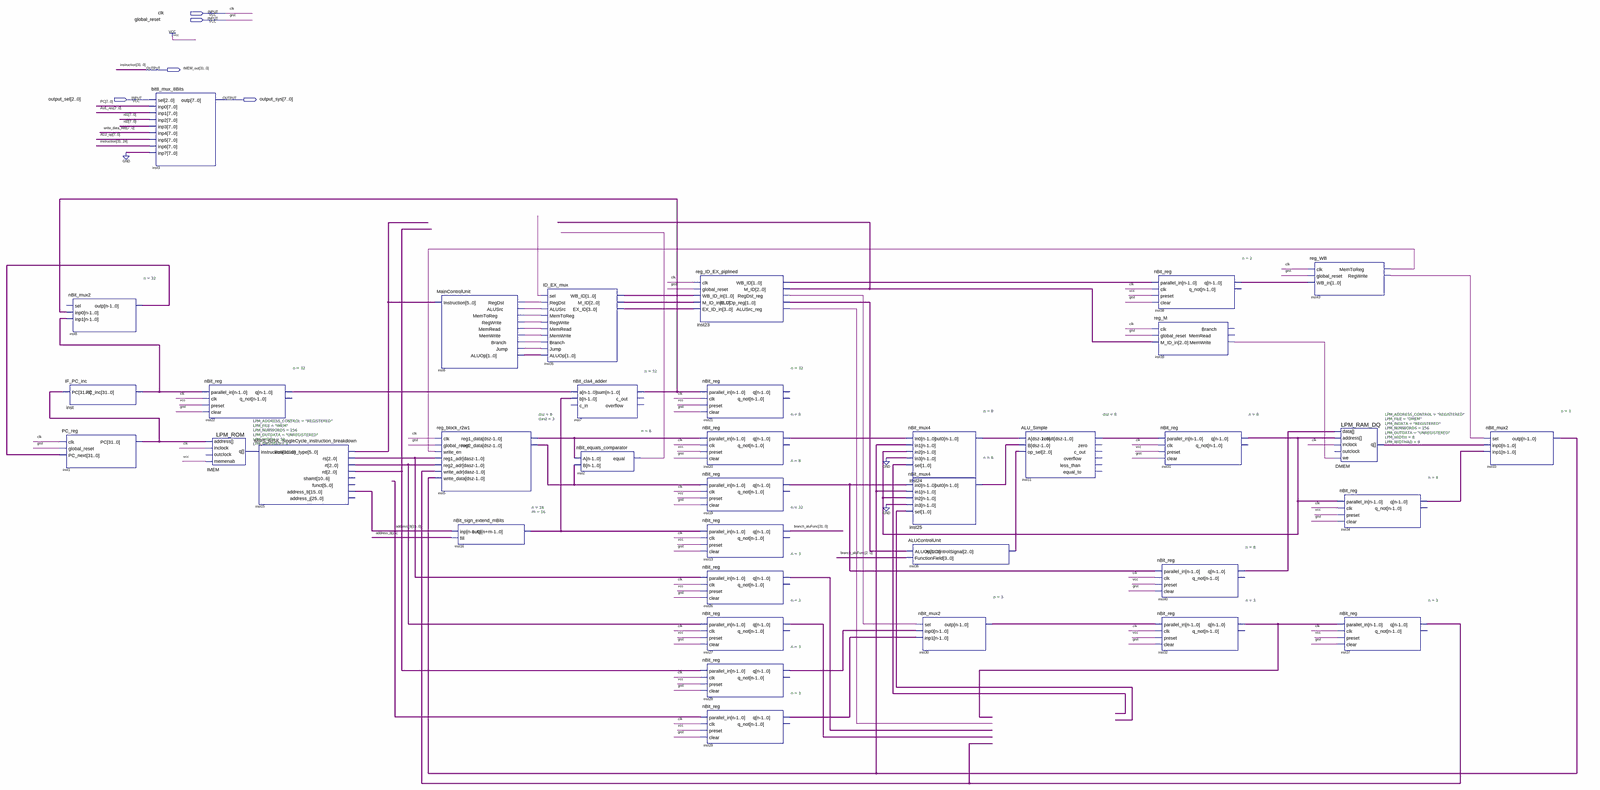
[diagram p0: schematic sheet, whole]
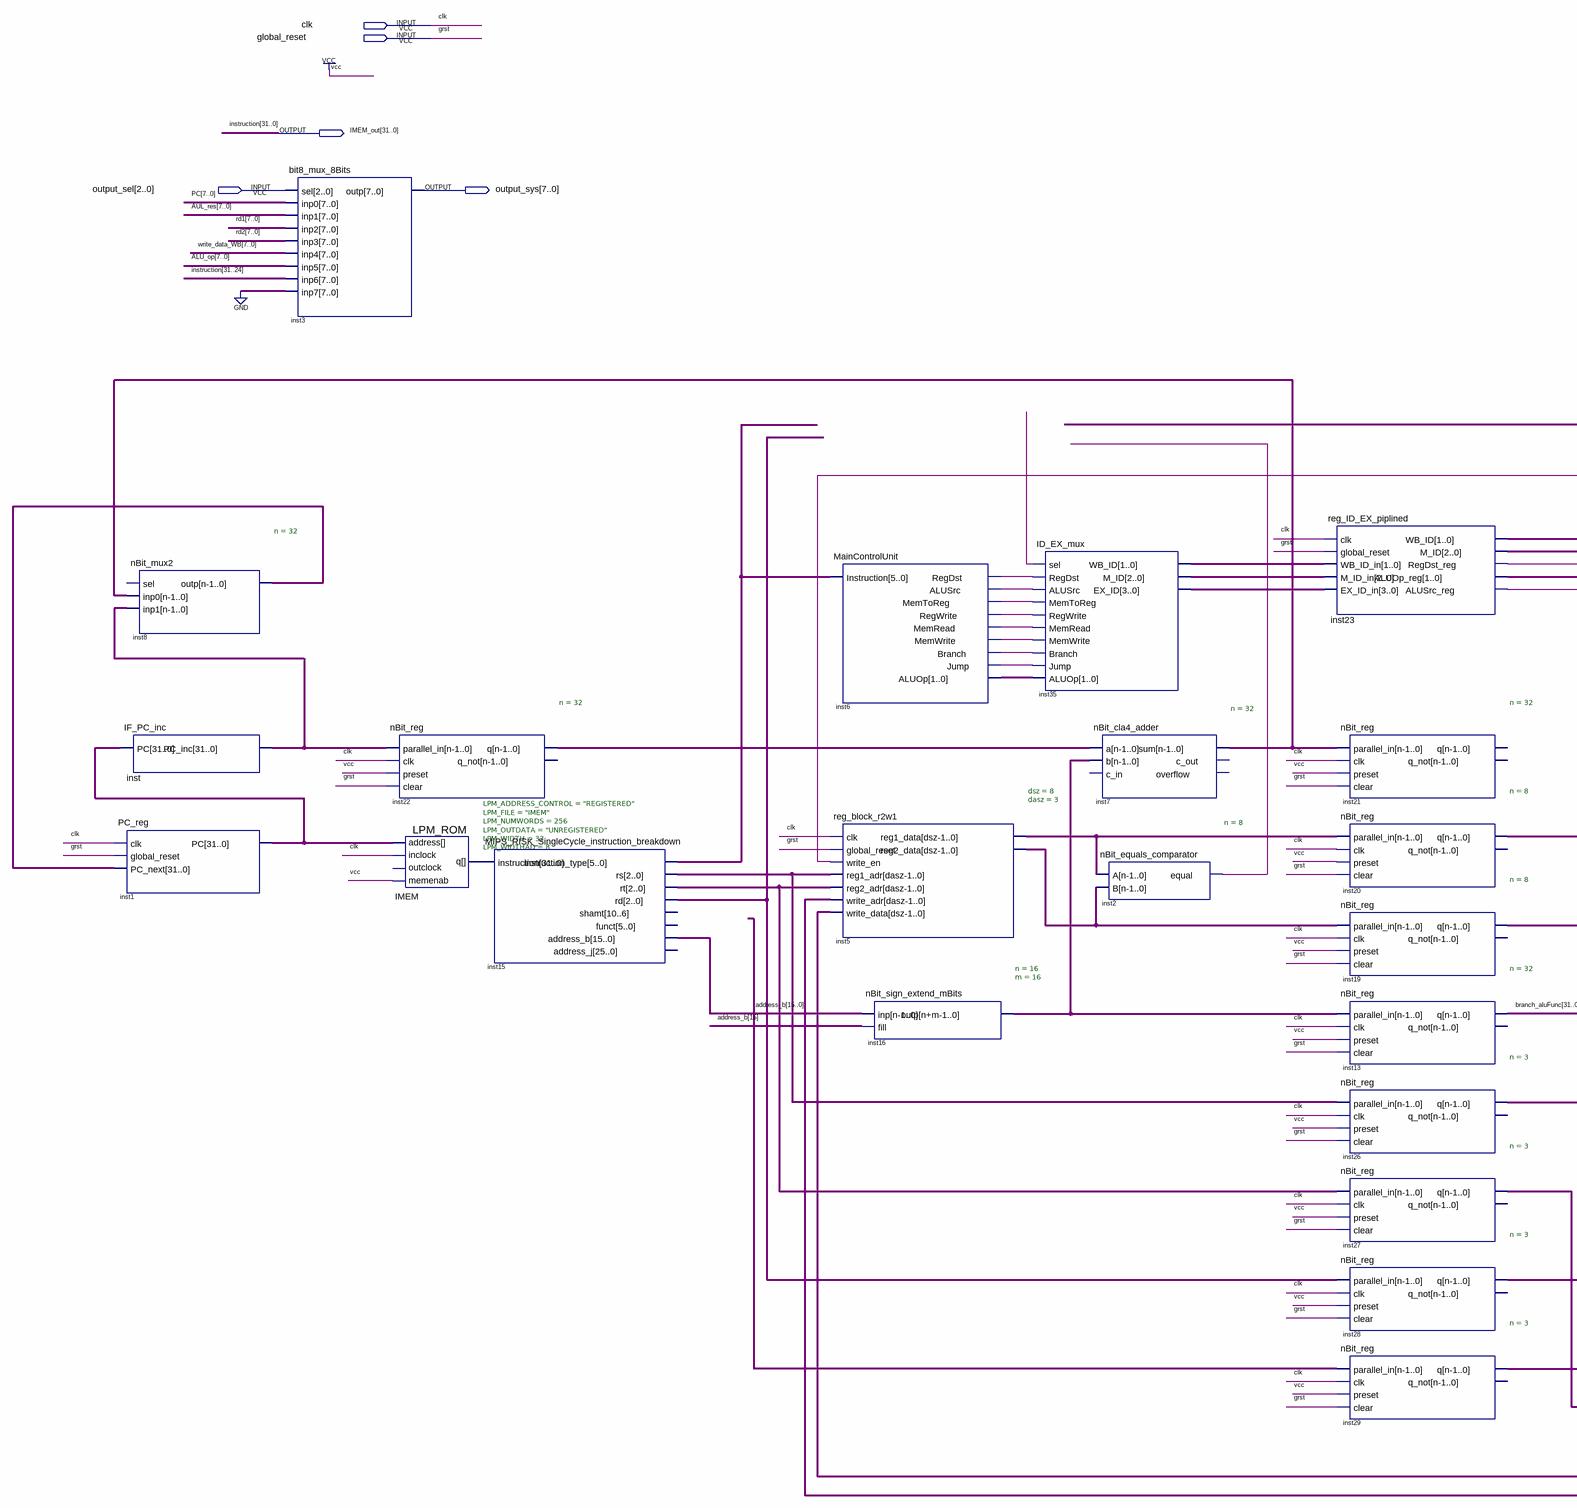
[diagram p1: schematic sheet, left part]
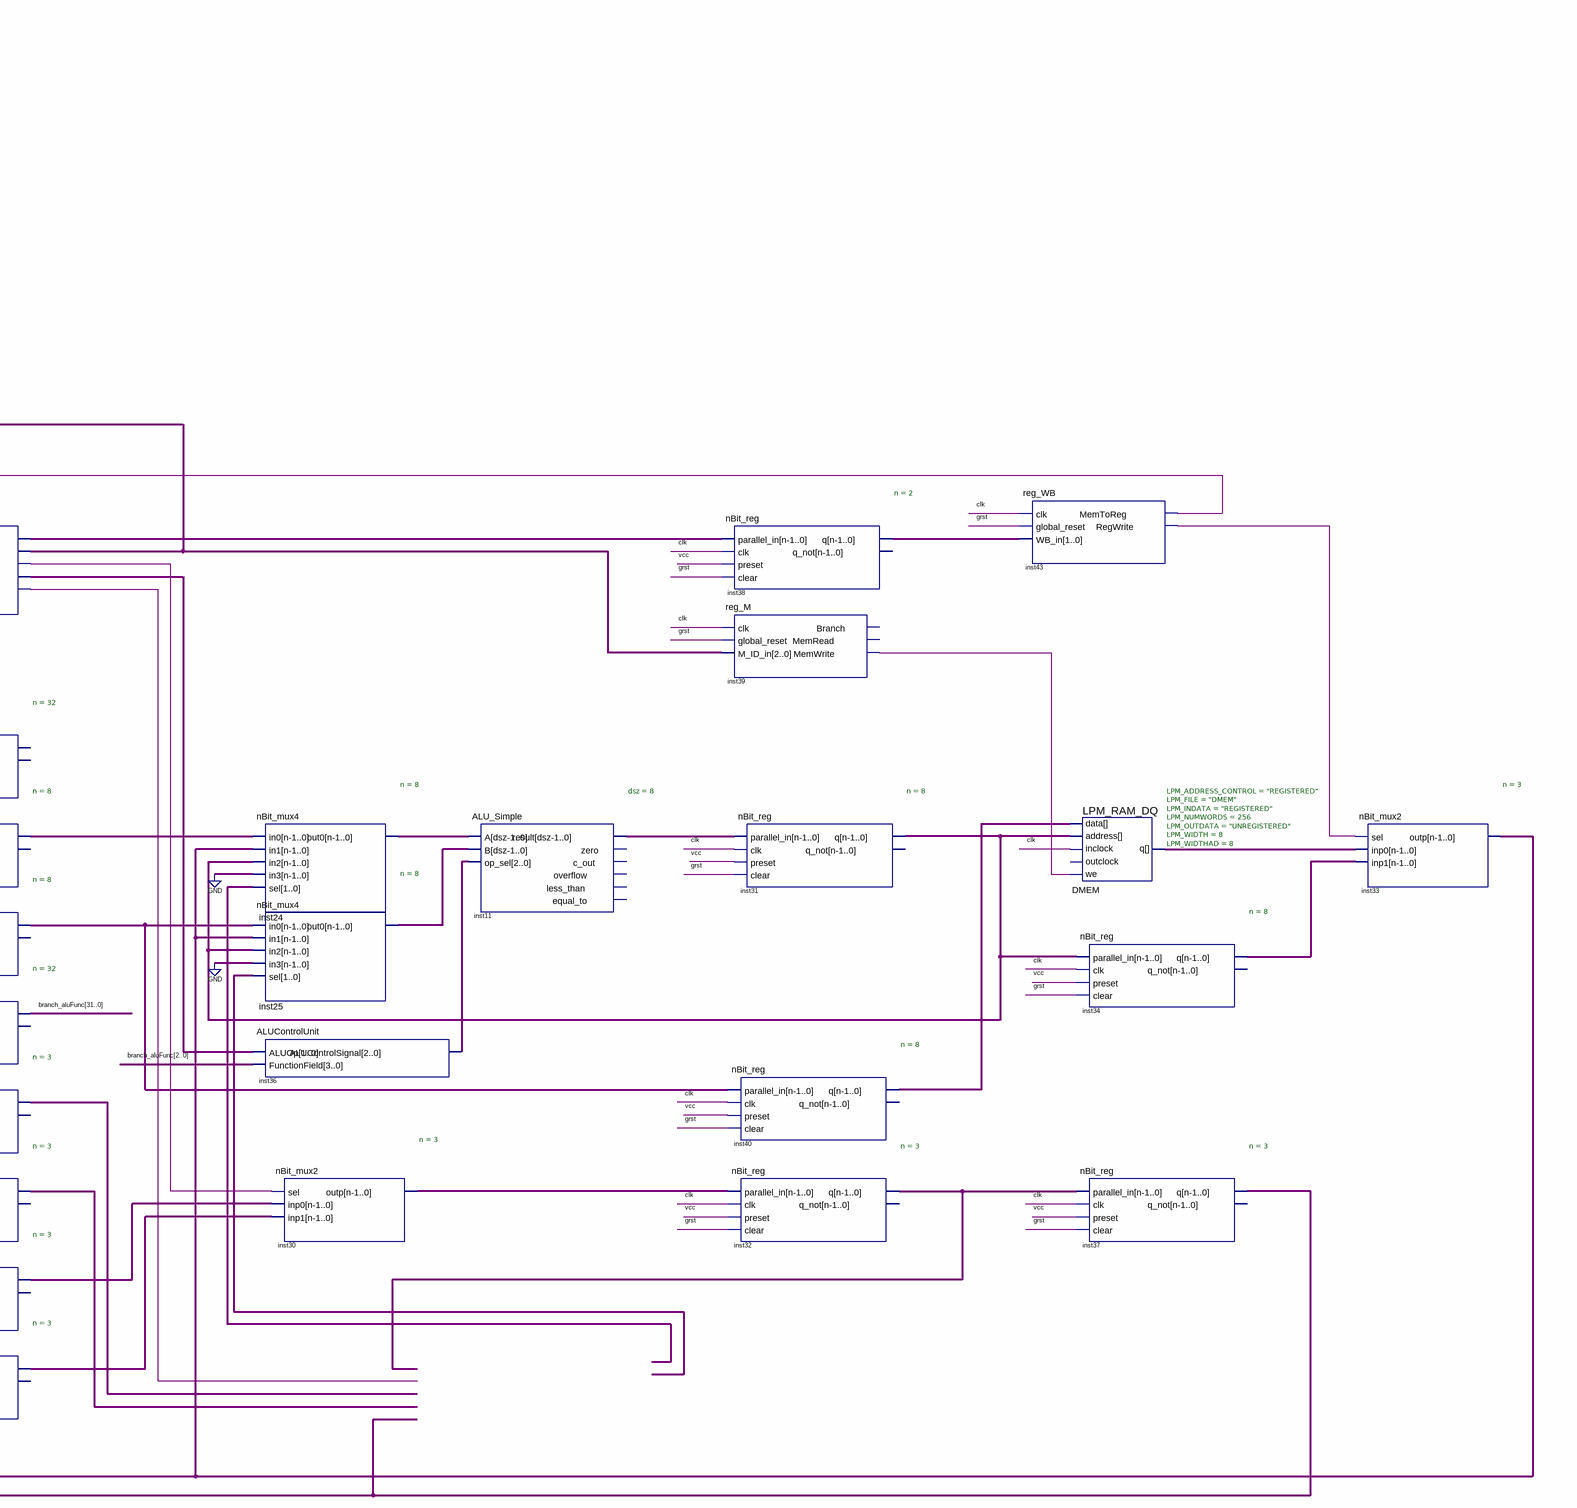
[diagram p2: schematic sheet, right part]
// Quartus schematic pipelined_processer.bdf as structural Verilog: 37 symbols, 5 pins
module pipelined_processer (
  input  clk,
  input  global_reset,
  input  [2:0] output_sel,
  output [31:0] IMEM_out,
  output [7:0] output_sys
);

  wire inst2_equal, inst6_alusrc, inst6_branch, inst6_jump, inst6_memread, inst6_memtoreg, inst6_memwrite,
       inst6_regdst, inst6_regwrite, inst23_alusrc_reg, inst23_regdst_reg, inst39_memwrite, inst43_memtoreg,
       inst43_regwrite, undriven_2;
  wire [1:0] inst6_aluop, inst23_aluop_reg, inst23_wb_id, inst35_wb_id, inst38_q, undriven_3, undriven_4;
  wire [2:0] inst15_rd, inst15_rs, inst15_rt, inst23_m_id, inst26_q, inst27_q, inst28_q, inst29_q,
       inst30_outp, inst32_q, inst35_m_id, inst36_alucontrolsignal, inst37_q, undriven;
  wire [3:0] inst35_ex_id;
  wire [5:0] inst15_instruction_type;
  wire [7:0] ALU_op, AUL_res, DMEM_q, inst5_reg1_data, inst5_reg2_data, inst11_result, inst19_q, inst20_q,
       inst24_out0, inst25_out0, inst31_q, inst33_outp, inst34_q, inst40_q, PC, rd1, rd2, write_data_WB;
  wire [15:0] address_b;
  wire [31:0] branch_aluFunc, IMEM_q, inst1_pc, inst7_sum, inst8_outp, inst16_outp, inst22_q, inst_pc_inc;

  nBit_mux2 #(.n(32)) inst8 (.inp0(inst7_sum), .inp1(inst_pc_inc), .outp(inst8_outp));  // open: sel
  IF_PC_inc inst (.PC(inst1_pc), .PC_inc(inst_pc_inc));
  PC_reg inst1 (.clk(clk), .global_reset(global_reset), .PC_next(inst8_outp), .PC(inst1_pc));
  bit8_mux_8Bits inst3 (
    .sel(output_sel), .inp0(PC), .inp1(AUL_res), .inp2(rd1), .inp3(rd2), .inp4(write_data_WB), .inp5(ALU_op),
    .inp6(IMEM_out[31:24]), .inp7({8{1'b0}}), .outp(output_sys));
  nBit_reg #(.n(32)) inst22 (
    .parallel_in(inst_pc_inc), .clk(clk), .preset(1'b1), .clear(global_reset), .q(inst22_q));  // open: q_not
  LPM_ROM #(.LPM_ADDRESS_CONTROL("REGISTERED"), .LPM_FILE("IMEM"), .LPM_NUMWORDS(256), .LPM_OUTDATA("UNREGISTERED"), .LPM_WIDTH(32), .LPM_WIDTHAD(8)) IMEM (
    .address(inst1_pc), .inclock(clk), .memenab(1'b1), .q(IMEM_q));  // open: outclock
  MIPS_RISK_SingleCycle_instruction_breakdown inst15 (
    .instruction(IMEM_q), .instruction_type(inst15_instruction_type), .rs(inst15_rs), .rt(inst15_rt),
    .rd(inst15_rd), .address_b(address_b));  // open: shamt, funct, address_j
  MainControlUnit inst6 (
    .Instruction(inst15_instruction_type), .RegDst(inst6_regdst), .ALUSrc(inst6_alusrc),
    .MemToReg(inst6_memtoreg), .RegWrite(inst6_regwrite), .MemRead(inst6_memread), .MemWrite(inst6_memwrite),
    .Branch(inst6_branch), .Jump(inst6_jump), .ALUOp(inst6_aluop));
  reg_block_r2w1 #(.dsz(8), .dasz(3)) inst5 (
    .clk(clk), .global_reset(global_reset), .write_en(inst43_memtoreg), .reg1_adr(inst15_rs),
    .reg2_adr(inst15_rt), .write_adr(inst37_q), .write_data(inst33_outp), .reg1_data(inst5_reg1_data),
    .reg2_data(inst5_reg2_data));
  nBit_sign_extend_mBits #(.n(16), .m(16)) inst16 (.inp(address_b), .fill(address_b[15]), .outp(inst16_outp));
  ID_EX_mux inst35 (
    .sel(undriven_2), .RegDst(inst6_regdst), .ALUSrc(inst6_alusrc), .MemToReg(inst6_memtoreg),
    .RegWrite(inst6_regwrite), .MemRead(inst6_memread), .MemWrite(inst6_memwrite), .Branch(inst6_branch),
    .Jump(inst6_jump), .ALUOp(inst6_aluop), .WB_ID(inst35_wb_id), .M_ID(inst35_m_id), .EX_ID(inst35_ex_id));
  nBit_cla4_adder #(.n(32)) inst7 (.a(inst22_q), .b(inst16_outp), .sum(inst7_sum));  // open: c_in, c_out, overflow
  nBit_equals_comparator #(.n(8)) inst2 (.A(inst5_reg1_data), .B(inst5_reg2_data), .equal(inst2_equal));
  reg_ID_EX_piplined inst23 (
    .clk(clk), .global_reset(global_reset), .WB_ID_in(inst35_wb_id), .M_ID_in(inst35_m_id),
    .EX_ID_in(inst35_ex_id), .WB_ID(inst23_wb_id), .M_ID(inst23_m_id), .RegDst_reg(inst23_regdst_reg),
    .ALUOp_reg(inst23_aluop_reg), .ALUSrc_reg(inst23_alusrc_reg));
  nBit_reg #(.n(32)) inst21 (
    .parallel_in(inst7_sum), .clk(clk), .preset(1'b1), .clear(global_reset));  // open: q, q_not
  nBit_reg #(.n(8)) inst20 (
    .parallel_in(inst5_reg1_data), .clk(clk), .preset(1'b1), .clear(global_reset), .q(inst20_q));  // open: q_not
  nBit_reg #(.n(8)) inst19 (
    .parallel_in(inst5_reg2_data), .clk(clk), .preset(1'b1), .clear(global_reset), .q(inst19_q));  // open: q_not
  nBit_reg #(.n(32)) inst13 (
    .parallel_in(inst16_outp), .clk(clk), .preset(1'b1), .clear(global_reset), .q(branch_aluFunc));  // open: q_not
  nBit_reg #(.n(3)) inst26 (
    .parallel_in(inst15_rs), .clk(clk), .preset(1'b1), .clear(global_reset), .q(inst26_q));  // open: q_not
  nBit_reg #(.n(3)) inst27 (
    .parallel_in(inst15_rt), .clk(clk), .preset(1'b1), .clear(global_reset), .q(inst27_q));  // open: q_not
  nBit_reg #(.n(3)) inst28 (
    .parallel_in(inst15_rd), .clk(clk), .preset(1'b1), .clear(global_reset), .q(inst28_q));  // open: q_not
  nBit_reg #(.n(3)) inst29 (
    .parallel_in(undriven), .clk(clk), .preset(1'b1), .clear(global_reset), .q(inst29_q));  // open: q_not
  nBit_mux4 #(.n(8)) inst24 (
    .in0(inst20_q), .in1(inst33_outp), .in2(inst31_q), .in3({8{1'b0}}), .sel(undriven_3), .out0(inst24_out0));
  nBit_mux4 #(.n(8)) inst25 (
    .in0(inst19_q), .in1(inst33_outp), .in2(inst31_q), .in3({8{1'b0}}), .sel(undriven_4), .out0(inst25_out0));
  ALUControlUnit inst36 (
    .ALUOp(inst23_aluop_reg), .FunctionField(branch_aluFunc[2:0]), .ALUControlSignal(inst36_alucontrolsignal));
  nBit_mux2 #(.n(3)) inst30 (.sel(inst23_regdst_reg), .inp0(inst28_q), .inp1(inst29_q), .outp(inst30_outp));
  ALU_Simple #(.dsz(8)) inst11 (
    .A(inst24_out0), .B(inst25_out0), .op_sel(inst36_alucontrolsignal), .result(inst11_result));  // open: zero, c_out, overflow, less_than, equal_to
  nBit_reg #(.n(2)) inst38 (
    .parallel_in(inst23_wb_id), .clk(clk), .preset(1'b1), .clear(global_reset), .q(inst38_q));  // open: q_not
  reg_M inst39 (
    .clk(clk), .global_reset(global_reset), .M_ID_in(inst23_m_id), .MemWrite(inst39_memwrite));  // open: Branch, MemRead
  nBit_reg #(.n(8)) inst31 (
    .parallel_in(inst11_result), .clk(clk), .preset(1'b1), .clear(global_reset), .q(inst31_q));  // open: q_not
  nBit_reg #(.n(8)) inst40 (
    .parallel_in(inst19_q), .clk(clk), .preset(1'b1), .clear(global_reset), .q(inst40_q));  // open: q_not
  nBit_reg #(.n(3)) inst32 (
    .parallel_in(inst30_outp), .clk(clk), .preset(1'b1), .clear(global_reset), .q(inst32_q));  // open: q_not
  reg_WB inst43 (
    .clk(clk), .global_reset(global_reset), .WB_in(inst38_q), .MemToReg(inst43_memtoreg),
    .RegWrite(inst43_regwrite));
  LPM_RAM_DQ #(.LPM_ADDRESS_CONTROL("REGISTERED"), .LPM_FILE("DMEM"), .LPM_INDATA("REGISTERED"), .LPM_NUMWORDS(256), .LPM_OUTDATA("UNREGISTERED"), .LPM_WIDTH(8), .LPM_WIDTHAD(8)) DMEM (
    .inclock(clk), .data(inst40_q), .address(inst31_q), .we(inst39_memwrite), .q(DMEM_q));  // open: outclock
  nBit_reg #(.n(8)) inst34 (
    .parallel_in(inst31_q), .clk(clk), .preset(1'b1), .clear(global_reset), .q(inst34_q));  // open: q_not
  nBit_reg #(.n(3)) inst37 (
    .parallel_in(inst32_q), .clk(clk), .preset(1'b1), .clear(global_reset), .q(inst37_q));  // open: q_not
  nBit_mux2 #(.n(3)) inst33 (.sel(inst43_regwrite), .inp0(DMEM_q), .inp1(inst34_q), .outp(inst33_outp));

  // Other names for the same wires on the sheet: grst = global_reset; instruction[31:0] = IMEM_out
endmodule
